# Altium schematic sheet BoardB-Input.SchDoc
size A; SheetNumber: 7; SheetTotal: 7
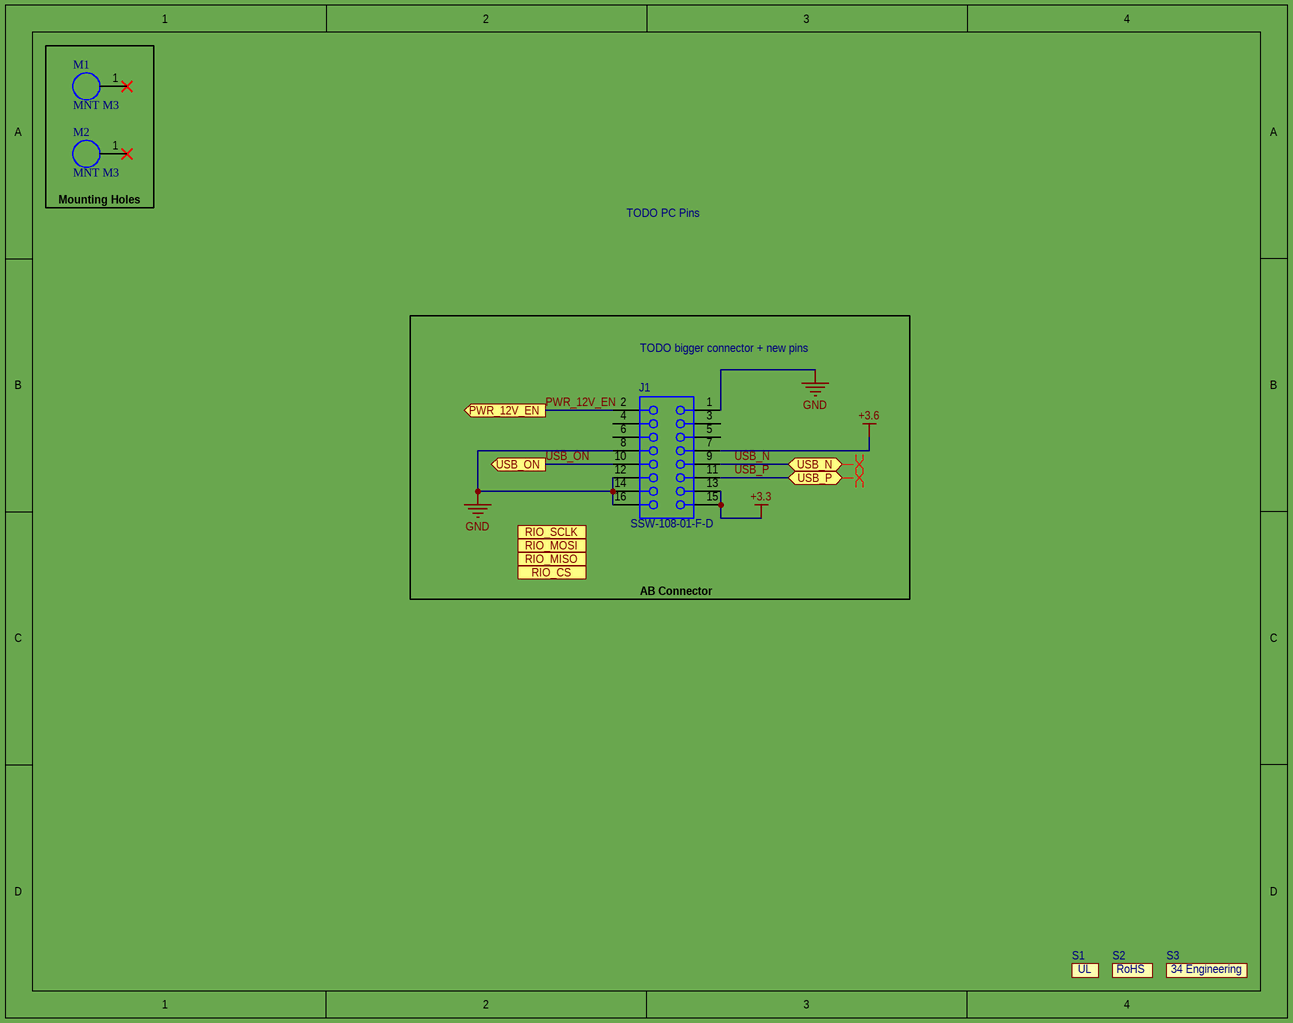
[diagram p0: BoardB-Input.SchDoc]

## Parts
J1  SSW-108-01-F-D  [SMTC-SSW-108-01-X-D]
M1  MNT M3  [MNT M3]
M2  MNT M3  [MNT M3]
S1  (no value)  [UL]
S2  (no value)  [RoHS]
S3  (no value)  [34EngineeringLogo]

## Blocks framed on the sheet
Mounting Holes: M1 M2

## Ports
PWR_12V_EN (out), RIO_CS (in), RIO_MISO (out), RIO_MOSI (in), RIO_SCLK (in), USB_N (bidir), USB_ON (out), USB_P (bidir)

## Nets
+3.3: J1.13 J1.15
+3.6: J1.7
GND: J1.1 J1.8 J1.12 J1.14 J1.16
PWR_12V_EN: J1.2 ; port PWR_12V_EN
USB_N: J1.9 ; port USB_N
USB_ON: J1.10 ; port USB_ON
USB_P: J1.11 ; port USB_P

Not connected (* = marked no-connect by the designer): J1 3 4 5 6; M1 1*; M2 1*

## Layout directives
differential pair; differential pair class USB: USB_N, USB_P

## Notes on the sheet
- TODO PC Pins
- TODO bigger connector + new pins
- AB Connector
- (in symbol 34EngineeringLogo) 34 Engineering

## Library data of the parts
J1 = CMP-1023-00376-1: SQ Post Socket, Through-hole, Vertical, -55 to 125 degC, 2.54mm Pitch, 16-Pin, Female, RoHS; Manufacturer: Samtec; PackageVersion: CA, 6/1987; DatasheetVersion: F-214; ComponentLink1Description: Manufacturer URL; ComponentLink1URL: http://www.samtec.com; ComponentLink2Description: Datasheet; PartNumber: SSW-108-01-F-D; PackageDescription: Assembly, Socket Strip .016 X .031 Tail; RoHS: True; Pitch: 2.54 mm; ComponentLink2URL: http://www.samtec.com/documents/webfiles/pdf/SSW_TH.PDF; Orientation: Vertical; ComponentLink3URL: http://www.samtec.com/documents/webfiles/cpdf/SSW-1XX-XX-XXX-X-XX-XXX-XX-MKT.pdf; PackageReference: SSW-108-01-X-D; Mounting Technology: Through-hole; ComponentLink3Description: Package Specification; Temperature Range: -55 to 125 degC
M1 M2 = MNT M3: Mounting hole for an M3 bolt
S1 = UL
S2 = RoHS
S3 = 34EngineeringLogo: 34 Engineering Silkscreen Logo